# EAGLE design nanoController (EAGLE 9.6.1)
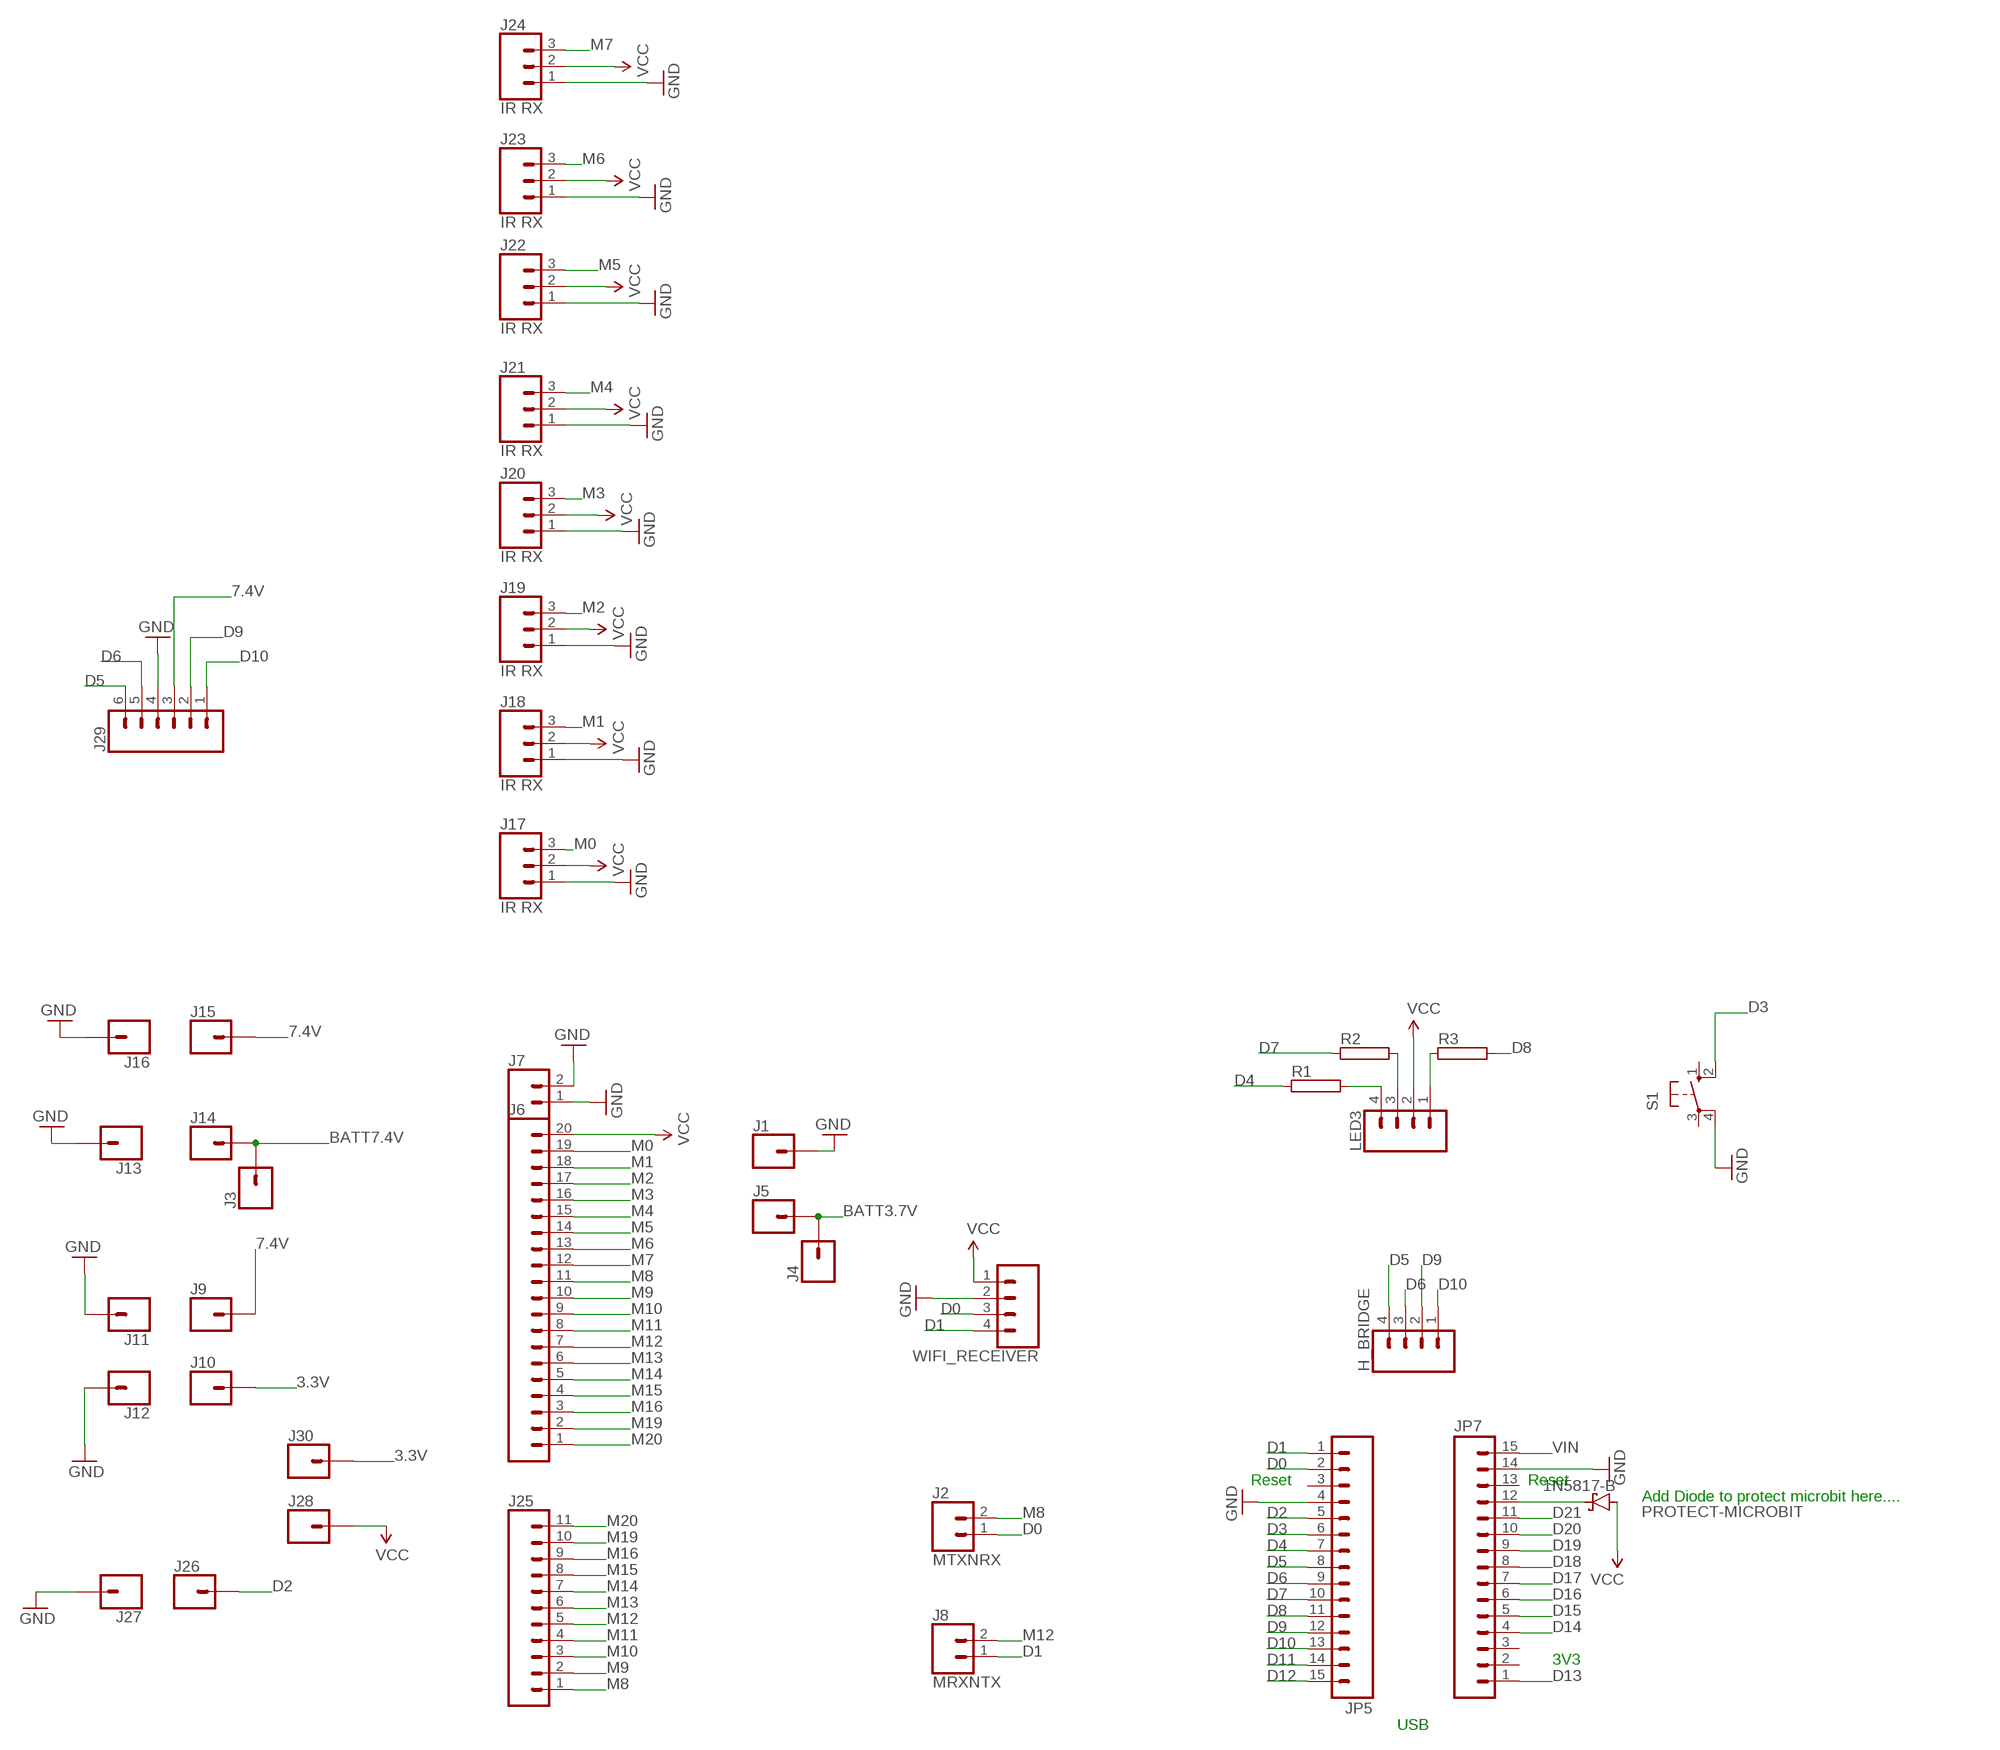
[diagram p0: schematic, sheet 1]

## Parts
H_BRIDGE  CONN_04LONGPADS  [1X04_LONGPADS]
J1  CONN_01SMTSO-256-ET-0.165DIA  [SMTSO-256-ET-0.165DIA]
J2  MTXNRX  CONN_02  [1X02]
J3  CONN_01  [1X01]
J4  CONN_01  [1X01]
J5  CONN_01SMTSO-256-ET-0.165DIA  [SMTSO-256-ET-0.165DIA]
J6  CONN_20  [1X20]
J7  CONN_02  [1X02]
J8  MRXNTX  CONN_02  [1X02]
J9  CONN_01  [1X01]
J10  CONN_01  [1X01]
J11  CONN_01  [1X01]
J12  CONN_01  [1X01]
J13  CONN_01  [1X01]
J14  CONN_01  [1X01]
J15  CONN_01  [1X01]
J16  CONN_01  [1X01]
J17  IR RX  CONN_03  [1X03]
J18  IR RX  CONN_03  [1X03]
J19  IR RX  CONN_03  [1X03]
J20  IR RX  CONN_03  [1X03]
J21  IR RX  CONN_03  [1X03]
J22  IR RX  CONN_03  [1X03]
J23  IR RX  CONN_03  [1X03]
J24  IR RX  CONN_03  [1X03]
J25  CONN_11  [1X11]
J26  CONN_01  [1X01]
J27  CONN_01  [1X01]
J28  CONN_01  [1X01]
J29  CONN_06SILK_FEMALE_PTH  [1X06]
J30  CONN_01  [1X01]
JP5  M15  [1X15]
JP7  M15  [1X15]
LED3  CONN_04LONGPADS  [1X04_LONGPADS]
PROTECT-MICROBIT  1N5817-B  [DO41-7.6]
R1  RHPS58  [HPS58]
R2  RHPS58  [HPS58]
R3  RHPS58  [HPS58]
S1  10-XX  [B3F-10XX]
WIFI_RECEIVER  CONN_04LONGPADS  [1X04_LONGPADS]

## Nets
3.3V: J10.1 J30.1
7.4V: J9.1 J15.1 J29.3
BATT3.7V: J4.1 J5.P$1
BATT7.4V: J3.1 J14.1
D0: J2.1 JP5.2 WIFI_RECEIVER.3
D1: J8.1 JP5.1 WIFI_RECEIVER.4
D2: J26.1 JP5.5
D3: JP5.6 S1.2(S1)
D4: JP5.7 R1.1
D5: H_BRIDGE.4 J29.6 JP5.8
D6: H_BRIDGE.3 J29.5 JP5.9
D7: JP5.10 R2.1
D8: JP5.11 R3.2
D9: H_BRIDGE.2 J29.2 JP5.12
D10: H_BRIDGE.1 J29.1 JP5.13
D11: JP5.14
D12: JP5.15
D13: JP7.1
D14: JP7.4
D15: JP7.5
D16: JP7.6
D17: JP7.7
D18: JP7.8
D19: JP7.9
D20: JP7.10
D21: JP7.11
GND [gnd]: J1.P$1 J7.1 J7.2 J11.1 J12.1 J13.1 J16.1 J17.1 J18.1 J19.1 J20.1 J21.1 J22.1 J23.1 J24.1 J27.1 J29.4 JP5.4 JP7.14 S1.4(P1) WIFI_RECEIVER.2
M0: J6.19 J17.3
M1: J6.18 J18.3
M2: J6.17 J19.3
M3: J6.16 J20.3
M4: J6.15 J21.3
M5: J6.14 J22.3
M6: J6.13 J23.3
M7: J6.12 J24.3
M8: J2.2 J6.11 J25.1
M9: J6.10 J25.2
M10: J6.9 J25.3
M11: J6.8 J25.4
M12: J6.7 J8.2 J25.5
M13: J6.6 J25.6
M14: J6.5 J25.7
M15: J6.4 J25.8
M16: J6.3 J25.9
M19: J6.2 J25.10
M20: J6.1 J25.11
N$1: LED3.4 R1.2
N$2: LED3.3 R2.2
N$3: LED3.1 R3.1
N$4: JP7.12 PROTECT-MICROBIT.C
VCC: J6.20 J17.2 J18.2 J19.2 J20.2 J21.2 J22.2 J23.2 J24.2 J28.1 LED3.2 PROTECT-MICROBIT.A WIFI_RECEIVER.1
VIN: JP7.15
Unconnected: JP5.3 JP7.2 JP7.3 JP7.13 S1.1(S) S1.3(P)

## Notes on the sheet
- Reset | Reset
- Add Diode to protect microbit here....
- 3V3
- USB

## Library data of the parts
H_BRIDGE LED3 WIFI_RECEIVER = SparkFun-Connectors:CONN_04: Multi connection point. Often used as Generic Header-pin footprint for 0.1 inch spaced/style header connections On any of the 0.1 inch spaced packages, you can populate with these: Break Away Headers - Straight <https://www.sparkfun.com/products/116> (PRT-00116) Break Away Male Headers - Right Angle <https://www.sparkfun.com/products/553> (PRT-00553) Female Headers <https://www.sparkfun.com/products/115> (PRT-00115) Break Away Headers - Machine Pin <https://www.sparkfun.com/products/117> (PRT-00117) Break Away Female Headers - Swiss Machine Pin <https://www.sparkfun.com/products/743> (PRT-00743) For SCREWTERMINALS and SPRING TERMINALS visit here: Screw Terimnals on SparkFun.com <https://www.sparkfun.com/search/results?term=Screw+Terminals> (5mm/3.5mm/2.54mm spacing) This device is also useful as a general connection point to wire up your design to another part of your project. Our various solder wires solder well into these plated through hole pads. Hook-Up Wire - Assortment (Stranded, 22 AWG) <https://www.sparkfun.com/products/11375> (PRT-11375) Hook-Up Wire - Assortment (Solid Core, 22 AWG) <https://www.sparkfun.com/products/11367> (PRT-11367) View the entire wire category on our website here <https://www.sparkfun.com/categories/141> Special notes: Molex polarized connector foot print use with SKU : PRT-08231 with associated crimp pins and housings. 1MM SMD Version SKU: PRT-10208; PROD_ID: CONN-09696
J1 J5 = SparkFun-Connectors:CONN_01: Single connection point. Often used as Generic Header-pin footprint for 0.1 inch spaced/style header connections On any of the 0.1 inch spaced packages, you can populate with these: Break Away Headers - Straight <https://www.sparkfun.com/products/116> (PRT-00116) Break Away Male Headers - Right Angle <https://www.sparkfun.com/products/553> (PRT-00553) Female Headers <https://www.sparkfun.com/products/115> (PRT-00115) Break Away Headers - Machine Pin <https://www.sparkfun.com/products/117> (PRT-00117) Break Away Female Headers - Swiss Machine Pin <https://www.sparkfun.com/products/743> (PRT-00743) This device is also useful as a general connection point to wire up your design to another part of your project. Our various solder wires solder well into these plated through hole pads. Hook-Up Wire - Assortment (Stranded, 22 AWG) <https://www.sparkfun.com/products/11375> (PRT-11375) Hook-Up Wire - Assortment (Solid Core, 22 AWG) <https://www.sparkfun.com/products/11367> (PRT-11367) View the entire wire category on our website here <https://www.sparkfun.com/categories/141> Special notes: SMTSO-256-ET is a "flush mount" nut for a 4-40 screw. We mostly use this on specialty testbeds; it is a nice way to connect hardware to your PCB at an adjustable hieght. Also note, the SNAP packages are for using a snappable style connector. We sell a baggie of snaps and they are also used on two LilyPad designs: Snap Assortment - 30 pack (male and female) <https://www.sparkfun.com/products/11347> (DEV-11347) LilyPad Arduino SimpleSnap <https://www.sparkfun.com/products/10941> (DEV-10941) LilyPad SimpleSnap Protoboard <https://www.sparkfun.com/products/10940> (DEV-10940); PROD_ID: HW-08694
J2 J7 J8 = SparkFun-Connectors:CONN_02: Multi connection point. Often used as Generic Header-pin footprint for 0.1 inch spaced/style header connections On any of the 0.1 inch spaced packages, you can populate with these: Break Away Headers - Straight <https://www.sparkfun.com/products/116> (PRT-00116) Break Away Male Headers - Right Angle <https://www.sparkfun.com/products/553> (PRT-00553) Female Headers <https://www.sparkfun.com/products/115> (PRT-00115) Break Away Headers - Machine Pin <https://www.sparkfun.com/products/117> (PRT-00117) Break Away Female Headers - Swiss Machine Pin <https://www.sparkfun.com/products/743> (PRT-00743) For SCREWTERMINALS and SPRING TERMINALS visit here: Screw Terimnals on SparkFun.com <https://www.sparkfun.com/search/results?term=Screw+Terminals> (5mm/3.5mm/2.54mm spacing) This device is also useful as a general connection point to wire up your design to another part of your project. Our various solder wires solder well into these plated through hole pads. Hook-Up Wire - Assortment (Stranded, 22 AWG) <https://www.sparkfun.com/products/11375> (PRT-11375) Hook-Up Wire - Assortment (Solid Core, 22 AWG) <https://www.sparkfun.com/products/11367> (PRT-11367) View the entire wire category on our website here <https://www.sparkfun.com/categories/141> Special notes: Molex polarized connector foot print use with: PRT-08233 with associated crimp pins and housings. 2.54_SCREWTERM for use with PRT-10571. 3.5mm Screw Terminal footprints for PRT-08084 5mm Screw Terminal footprints for use with PRT-08432
J3 J4 J9-J16 J26-J28 J30 = SparkFun-Connectors:CONN_01: Single connection point. Often used as Generic Header-pin footprint for 0.1 inch spaced/style header connections On any of the 0.1 inch spaced packages, you can populate with these: Break Away Headers - Straight <https://www.sparkfun.com/products/116> (PRT-00116) Break Away Male Headers - Right Angle <https://www.sparkfun.com/products/553> (PRT-00553) Female Headers <https://www.sparkfun.com/products/115> (PRT-00115) Break Away Headers - Machine Pin <https://www.sparkfun.com/products/117> (PRT-00117) Break Away Female Headers - Swiss Machine Pin <https://www.sparkfun.com/products/743> (PRT-00743) This device is also useful as a general connection point to wire up your design to another part of your project. Our various solder wires solder well into these plated through hole pads. Hook-Up Wire - Assortment (Stranded, 22 AWG) <https://www.sparkfun.com/products/11375> (PRT-11375) Hook-Up Wire - Assortment (Solid Core, 22 AWG) <https://www.sparkfun.com/products/11367> (PRT-11367) View the entire wire category on our website here <https://www.sparkfun.com/categories/141> Special notes: SMTSO-256-ET is a "flush mount" nut for a 4-40 screw. We mostly use this on specialty testbeds; it is a nice way to connect hardware to your PCB at an adjustable hieght. Also note, the SNAP packages are for using a snappable style connector. We sell a baggie of snaps and they are also used on two LilyPad designs: Snap Assortment - 30 pack (male and female) <https://www.sparkfun.com/products/11347> (DEV-11347) LilyPad Arduino SimpleSnap <https://www.sparkfun.com/products/10941> (DEV-10941) LilyPad SimpleSnap Protoboard <https://www.sparkfun.com/products/10940> (DEV-10940)
J6 = SparkFun-Connectors:CONN_20: Multi connection point. Often used as Generic Header-pin footprint for 0.1 inch spaced/style header connections On any of the 0.1 inch spaced packages, you can populate with these: Break Away Headers - Straight <https://www.sparkfun.com/products/116> (PRT-00116) Break Away Male Headers - Right Angle <https://www.sparkfun.com/products/553> (PRT-00553) Female Headers <https://www.sparkfun.com/products/115> (PRT-00115) Break Away Headers - Machine Pin <https://www.sparkfun.com/products/117> (PRT-00117) Break Away Female Headers - Swiss Machine Pin <https://www.sparkfun.com/products/743> (PRT-00743) For SCREWTERMINALS and SPRING TERMINALS visit here: Screw Terimnals on SparkFun.com <https://www.sparkfun.com/search/results?term=Screw+Terminals> (5mm/3.5mm/2.54mm spacing) This device is also useful as a general connection point to wire up your design to another part of your project. Our various solder wires solder well into these plated through hole pads. Hook-Up Wire - Assortment (Stranded, 22 AWG) <https://www.sparkfun.com/products/11375> (PRT-11375) Hook-Up Wire - Assortment (Solid Core, 22 AWG) <https://www.sparkfun.com/products/11367> (PRT-11367) View the entire wire category on our website here <https://www.sparkfun.com/categories/141> Special notes: Molex polarized connector foot print use with SKU : PRT-08231 with associated crimp pins and housings. 1MM SMD Version SKU: PRT-10208 NOTES ON THE VARIANTS LOCK and LOCK_LONGPADS... This footprint was designed to help hold the alignment of a through-hole component (i.e. 6-pin header) while soldering it into place. You may notice that each hole has been shifted either up or down by 0.005 of an inch from it's more standard position (which is a perfectly straight line). This slight alteration caused the pins (the squares in the middle) to touch the edges of the holes. Because they are alternating, it causes a "brace" to hold the component in place. 0.005 has proven to be the perfect amount of "off-center" position when using our standard breakaway headers. Although looks a little odd when you look at the bare footprint, once you have a header in there, the alteration is very hard to notice. Also,if you push a header all the way into place, it is covered up entirely on the bottom side. Note about LOCK SPECIAL package: This is just like the LOCK variant in that the holes are staggared by 5 mil, but except for the last two holes. They are not altered from the "standard" footprint layout. This is used for a special purpose on the layout of our Graphic LCD Backpack. Make sure you want to use this device before selecting it for you project!
J17-J24 = SparkFun-Connectors:CONN_03: Multi connection point. Often used as Generic Header-pin footprint for 0.1 inch spaced/style header connections On any of the 0.1 inch spaced packages, you can populate with these: Break Away Headers - Straight <https://www.sparkfun.com/products/116> (PRT-00116) Break Away Male Headers - Right Angle <https://www.sparkfun.com/products/553> (PRT-00553) Female Headers <https://www.sparkfun.com/products/115> (PRT-00115) Break Away Headers - Machine Pin <https://www.sparkfun.com/products/117> (PRT-00117) Break Away Female Headers - Swiss Machine Pin <https://www.sparkfun.com/products/743> (PRT-00743) Stackable Header - 3 Pin (Female, 0.1") <https://www.sparkfun.com/products/13875> (PRT-13875) For SCREWTERMINALS and SPRING TERMINALS visit here: Screw Terimnals on SparkFun.com <https://www.sparkfun.com/search/results?term=Screw+Terminals> (5mm/3.5mm/2.54mm spacing) This device is also useful as a general connection point to wire up your design to another part of your project. Our various solder wires solder well into these plated through hole pads. Hook-Up Wire - Assortment (Stranded, 22 AWG) <https://www.sparkfun.com/products/11375> (PRT-11375) Hook-Up Wire - Assortment (Solid Core, 22 AWG) <https://www.sparkfun.com/products/11367> (PRT-11367) View the entire wire category on our website here <https://www.sparkfun.com/categories/141> Special notes: Molex polarized connector foot print use with SKU : PRT-08232 with associated crimp pins and housings.; PROD_ID: XXX-00000; VALUE: 455-1750-1-ND
J25 = SparkFun-Connectors:CONN_11: Multi connection point. Often used as Generic Header-pin footprint for 0.1 inch spaced/style header connections On any of the 0.1 inch spaced packages, you can populate with these: Break Away Headers - Straight <https://www.sparkfun.com/products/116> (PRT-00116) Break Away Male Headers - Right Angle <https://www.sparkfun.com/products/553> (PRT-00553) Female Headers <https://www.sparkfun.com/products/115> (PRT-00115) Break Away Headers - Machine Pin <https://www.sparkfun.com/products/117> (PRT-00117) Break Away Female Headers - Swiss Machine Pin <https://www.sparkfun.com/products/743> (PRT-00743) For SCREWTERMINALS and SPRING TERMINALS visit here: Screw Terimnals on SparkFun.com <https://www.sparkfun.com/search/results?term=Screw+Terminals> (5mm/3.5mm/2.54mm spacing) This device is also useful as a general connection point to wire up your design to another part of your project. Our various solder wires solder well into these plated through hole pads. Hook-Up Wire - Assortment (Stranded, 22 AWG) <https://www.sparkfun.com/products/11375> (PRT-11375) Hook-Up Wire - Assortment (Solid Core, 22 AWG) <https://www.sparkfun.com/products/11367> (PRT-11367) View the entire wire category on our website here <https://www.sparkfun.com/categories/141>
J29 = SparkFun-Connectors:CONN_06: Multi connection point. Often used as Generic Header-pin footprint for 0.1 inch spaced/style header connections On any of the 0.1 inch spaced packages, you can populate with these: Break Away Headers - Straight <https://www.sparkfun.com/products/116> (PRT-00116) Break Away Male Headers - Right Angle <https://www.sparkfun.com/products/553> (PRT-00553) Female Headers <https://www.sparkfun.com/products/115> (PRT-00115) Break Away Headers - Machine Pin <https://www.sparkfun.com/products/117> (PRT-00117) Break Away Female Headers - Swiss Machine Pin <https://www.sparkfun.com/products/743> (PRT-00743) Arduino Stackable Header - 6 Pin <https://www.sparkfun.com/products/9280> (PRT-09280) For SCREWTERMINALS and SPRING TERMINALS visit here: Screw Terimnals on SparkFun.com <https://www.sparkfun.com/search/results?term=Screw+Terminals> (5mm/3.5mm/2.54mm spacing) This device is also useful as a general connection point to wire up your design to another part of your project. Our various solder wires solder well into these plated through hole pads. Hook-Up Wire - Assortment (Stranded, 22 AWG) <https://www.sparkfun.com/products/11375> (PRT-11375) Hook-Up Wire - Assortment (Solid Core, 22 AWG) <https://www.sparkfun.com/products/11367> (PRT-11367) View the entire wire category on our website here <https://www.sparkfun.com/categories/141>; PROD_ID: CONN-08437
JP5 JP7 = SparkFun-Connectors:M15: Header 15 Standard 15-pin 0.1" header. Use with straight break away headers (SKU : PRT-00116), right angle break away headers (PRT-00553), swiss pins (PRT-00743), machine pins (PRT-00117), and female headers (PRT-00115).
PROTECT-MICROBIT = diode:1N581*: 1.0A SCHOTTKY BARRIER RECTIFIER Source: http://www.diodes.com/datasheets/ds23001.pdf
R1-R3 = resistor-power:R: Power Resitor; OC_FARNELL: unknown; OC_NEWARK: unknown
S1 = switch-omron:10-XX: OMRON SWITCH; MPN: B3F-1000; OC_FARNELL: 176432; OC_NEWARK: 36M3542

## Net classes
0 default: width 0.254 mm, clearance 0.254 mm
1 power: width 0.61 mm, drill 0.711 mm, clearance 0.33 mm
2 gnd: width 0.305 mm, drill 0.711 mm, clearance 0.254 mm
3 usbvcc: width 0.508 mm, drill 0.711 mm, clearance 0.254 mm
4 aref: width 0.406 mm

## Board
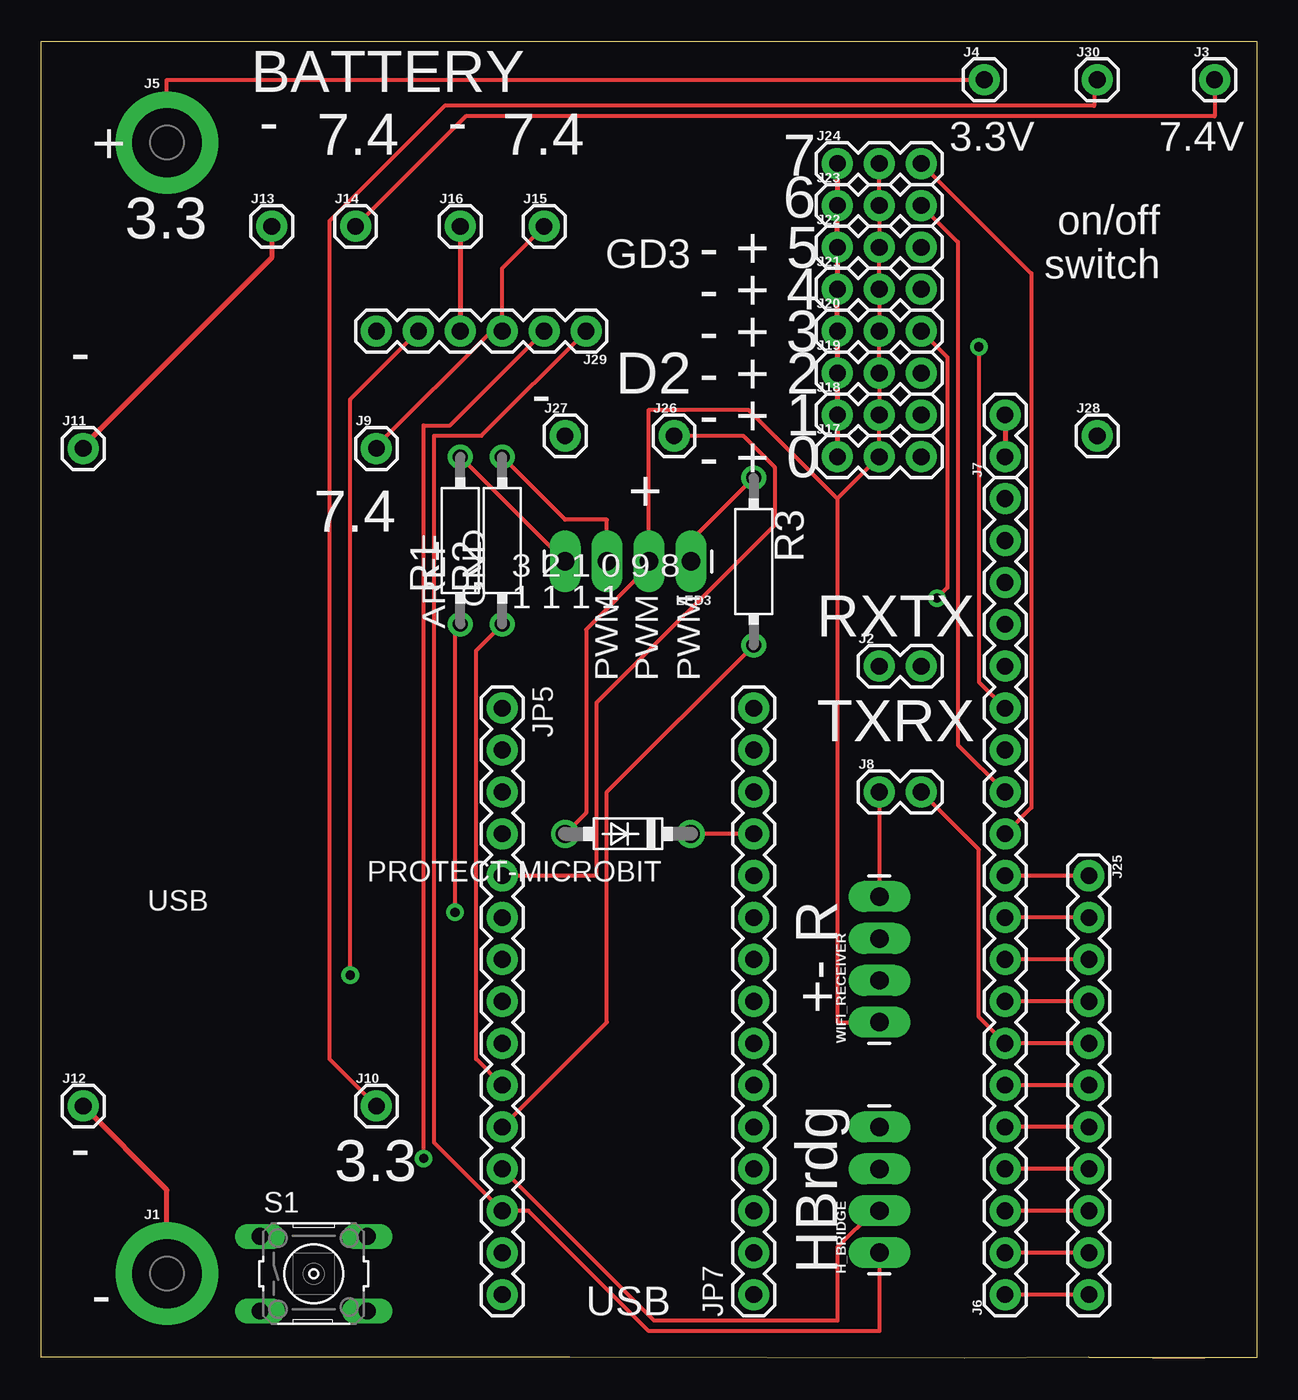
[diagram p1: board, top side]
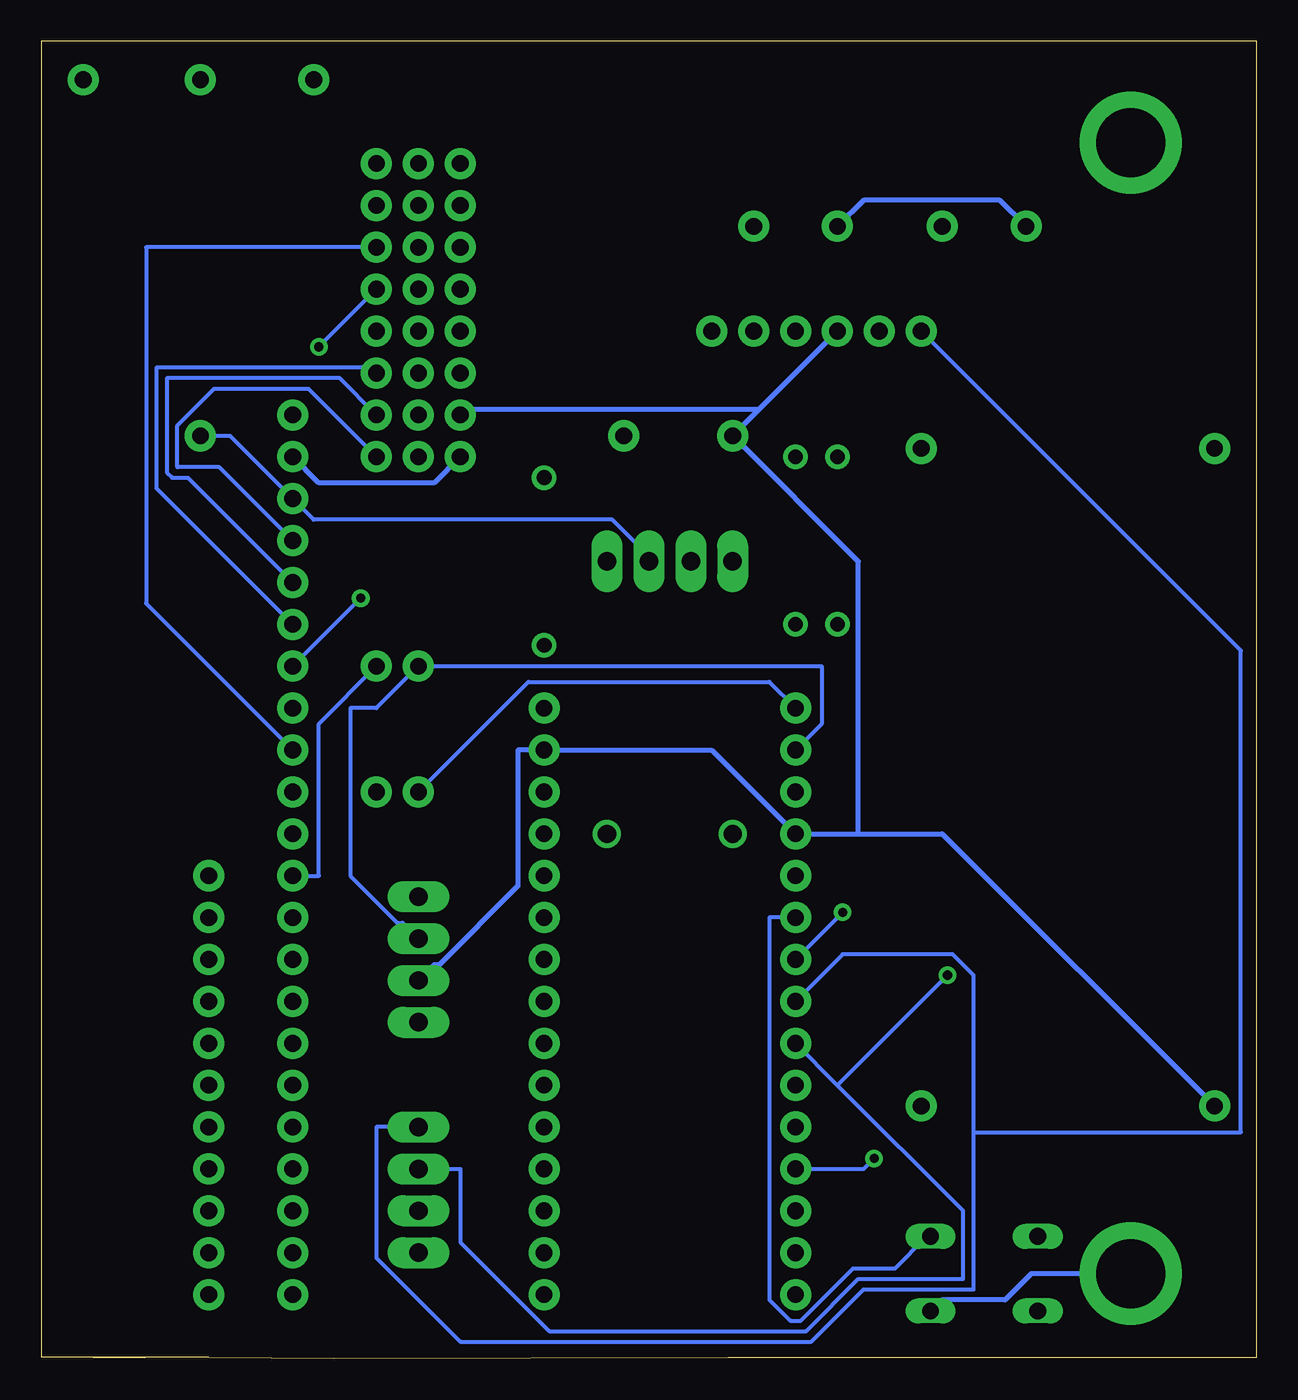
[diagram p2: board, bottom side, seen from below]

Size 73.66 x 79.86 mm. Coordinates in mm from the lower left corner, seen from the top.
Outline: 73.66,0.05 73.66,79.86 0,79.86 0,0.05 32.03,0.05 55.93,0 63.5,0.05 73.66,0.05
Outline: 67.36,0 73.66,0.05
Copper layers (1*16): Top 0.035mm / dielectric 1.5mm / Bottom 0.035mm
Design rules "default": minimum track width 10mil, minimum drill 22mil, track to track 10mil, track to pad 10mil, pad to pad 10mil, via to via 16mil, smd to smd 8mil, copper to edge 30mil, drill to drill 12mil, minimum pad ring 10mil, minimum via ring 10mil, stop-mask expansion 4mil, vias tented up to drill 0mil, thermal gap 10mil
vRestrict: area 25.4,45.5 to 27.1,49.2; area 33.4,41.1 to 34.9,44.6; area 35.9,41.1 to 37.5,44.6; area 38.5,41.1 to 40,44.6; area 42.5,38.7 to 43.1,38.9

### Footprints (pad centres in the part's own frame; a part is rotated, then mirrored left to right if it is on the bottom)
1X04_LONGPADS = drill 1.118 pad 1.88 long: 1 0,0; 2 2.54,0; 3 5.08,0; 4 7.62,0
SMTSO-256-ET-0.165DIA = drill 4.191 pad 6.198: P$1 0,0
1X02 = drill 1.016 pad 1.88: 1 0,0; 2 2.54,0
1X01 = drill 1.016 pad 1.88: 1 0,0
1X20 = drill 1.016 pad 1.88: 1 0,0; 2 2.54,0; 3 5.08,0; 4 7.62,0; 5 10.16,0; 6 12.7,0; 7 15.24,0; 8 17.78,0; 9 20.32,0; 10 22.86,0; 11 25.4,0; 12 27.94,0; 13 30.48,0; 14 33.02,0; 15 35.56,0; 16 38.1,0; 17 40.64,0; 18 43.18,0; 19 45.72,0; 20 48.26,0
1X03 = drill 1.016 pad 1.88: 1 0,0; 2 2.54,0; 3 5.08,0
1X11 = drill 1.016 pad 1.88: 1 0,0; 2 2.54,0; 3 5.08,0; 4 7.62,0; 5 10.16,0; 6 12.7,0; 7 15.24,0; 8 17.78,0; 9 20.32,0; 10 22.86,0; 11 25.4,0
1X06 = drill 1.016 pad 1.88: 1 0,0; 2 2.54,0; 3 5.08,0; 4 7.62,0; 5 10.16,0; 6 12.7,0
1X15 = drill 1.016 pad 1.88: 1 0,0; 2 2.54,0; 3 5.08,0; 4 7.62,0; 5 10.16,0; 6 12.7,0; 7 15.24,0; 8 17.78,0; 9 20.32,0; 10 22.86,0; 11 25.4,0; 12 27.94,0; 13 30.48,0; 14 33.02,0; 15 35.56,0
DO41-7.6 = drill 1.1 pad 1.7: A 3.81,0; C -3.81,0
HPS58 = drill 0.9 pad 1.5: 1 -5.08,0; 2 5.08,0
B3F-10XX = drill 1.016 long: 1 -3.251,2.261; 2 3.251,2.261; 3 -3.251,-2.261; 4 3.251,-2.261

### Placement (x,y rotation side)
H_BRIDGE  50.8,6.4 90 top
J1  7.62,5.13 0 top
J2  50.8,41.96 0 top
J3  71.12,77.52 0 top
J4  57.15,77.52 0 top
J5  7.62,73.71 0 top
J6  58.42,3.86 90 top
J7  58.42,54.66 90 top
J8  50.8,34.34 0 top
J9  20.32,55.17 0 top
J10  20.32,15.29 0 top
J11  2.54,55.17 0 top
J12  2.54,15.29 0 top
J13  13.97,68.63 0 top
J14  19.05,68.63 0 top
J15  30.48,68.63 0 top
J16  25.4,68.63 0 top
J17  48.26,54.66 0 top
J18  48.26,57.2 0 top
J19  48.26,59.74 0 top
J20  48.26,62.28 0 top
J21  48.26,64.82 0 top
J22  48.26,67.36 0 top
J23  48.26,69.9 0 top
J24  48.26,72.44 0 top
J25  63.5,29.26 270 top
J26  38.35,55.93 0 top
J27  31.75,55.93 0 top
J28  64.01,55.93 0 top
J29  33.02,62.28 180 top
J30  64.01,77.52 0 top
JP5  27.94,39.42 270 top
JP7  43.18,3.86 90 top
LED3  39.37,48.31 180 top
PROTECT-MICROBIT  35.56,31.8 180 top
R1  25.4,49.58 90 top
R2  27.94,49.58 90 top
R3  43.18,48.31 270 top
S1  16.51,5.13 0 top
WIFI_RECEIVER  50.8,20.37 90 top

### Tracks (layer width: path | path; a pad name or v marks a point on that pad's centre or on a via)
3.3V
  Top 0.254: J10.1 17.46,18.15 17.46,68.95 24.45,75.93 63.82,75.93 63.82,77.52 J30.1
7.4V
  Top 0.254: J9.1 20.32,55.3 27.3,62.28 J29.3 27.94,66.09 J15.1
BATT3.7V
  Top 0.254: J4.1 7.62,77.52 J5.P$1
BATT7.4V
  Top 0.254: J14.1 25.72,75.3 71.12,75.3 J3.1
D0
  Bottom 0.254: JP5.2 26.35,38.47 26.35,41.96 J2.1 53.34,39.42 54.93,39.42 54.93,29.26 52.07,26.4 51.75,26.4 WIFI_RECEIVER.3
D1
  Top 0.254: J8.1 WIFI_RECEIVER.4
  Bottom 0.254: JP5.1 29.53,41.01 44.13,41.01 J8.1
D2
  Top 0.254: JP5.5 33.66,29.26 33.66,39.74 44.45,50.53 44.45,54.03 42.55,55.93 J26.1
D3
  Bottom 0.254: JP5.6 29.53,26.72 29.53,3.54 28.26,2.27 27.62,2.27 24.45,5.45 21.91,5.45 20,7.35 S1.2
D4  (via drill 0.56)
  Top 0.254: R1.1 25.08,44.18 v25.08,27.04
  Bottom 0.254: JP5.7 v25.08,27.04
D5
  Bottom 0.254: JP5.8 25.08,24.5 18.41,24.5 17.14,23.23 17.14,13.7 | 17.14,13.7 17.14,4.18 23.81,4.18 26.99,1 48.26,1 53.34,6.08 53.34,14.02 H_BRIDGE.4 | J29.6 0.95,42.91 0.95,13.7 17.14,13.7
D6  (via drill 0.56)
  Top 0.254: J29.5 18.73,58.15 v18.73,23.23
  Bottom 0.254: 25.4,16.56 17.78,8.94 17.78,4.81 24.13,4.81 27.3,1.64 42.86,1.64 48.26,7.04 48.26,11.48 H_BRIDGE.3 | 25.4,16.56 JP5.9 | 25.4,16.56 v18.73,23.23
D7
  Top 0.254: R2.1 26.35,42.91 26.35,18.15 JP5.10
D8
  Top 0.254: R3.2 34.29,34.34 34.29,20.37 JP5.11
D9  (via drill 0.56)
  Top 0.254: JP5.12 37.15,2.27 48.26,2.27 48.26,6.72 50.48,8.94 H_BRIDGE.2 | J29.2 24.77,56.57 23.18,56.57 v23.18,12.12
  Bottom 0.254: v23.18,12.12 23.81,11.48 JP5.12
D10
  Top 0.254: H_BRIDGE.1 50.8,1.64 36.83,1.64 29.53,8.94 JP5.13 23.81,13.07 23.81,55.93 26.67,55.93 J29.1
GND
  Top 0.305: J24.1 J23.1 J22.1 J21.1 J20.1 J19.1 J18.1 J17.1 | J7.2 J7.1 | J16.1 J29.4 | J13.1 13.97,66.73 2.54,55.3 J11.1 | J12.1 7.62,10.21 J1.P$1
  Bottom 0.305: J7.1 56.83,53.07 49.85,53.07 J17.1 | J29.4 30.16,57.52 | 30.16,57.52 J27.1 24.13,48.31 24.13,31.8 | J16.1 23.81,70.22 15.56,70.22 J13.1 | J18.1 47.94,57.52 30.16,57.52 | J1.P$1 13.65,5.13 15.24,3.54 19.05,3.54 19.68,2.91 S1.4 | WIFI_RECEIVER.2 49.85,23.86 49.53,23.86 44.77,28.63 44.77,36.88 JP7.14 33.02,36.88 JP5.4 24.13,31.8 | J12.1 19.05,31.8 24.13,31.8
M0
  Bottom 0.254: J17.3 57.47,58.79 63.18,58.79 65.41,56.57 65.41,54.03 62.87,54.03 J6.19
M1
  Bottom 0.254: J6.18 64.77,53.39 65.72,53.39 66.04,53.71 66.04,59.42 55.56,59.42 J18.3
M2
  Bottom 0.254: J6.17 66.67,52.76 66.67,60.06 53.66,60.06 J19.3
M3  (via drill 0.56)
  Top 0.254: v54.29,46.09 54.93,46.72 54.93,60.69 J20.3
  Bottom 0.254: v54.29,46.09 J6.16
M4  (via drill 0.56)
  Top 0.254: J6.15 56.83,41.01 v56.83,61.33
  Bottom 0.254: J21.3 v56.83,61.33
M5
  Bottom 0.254: J6.14 67.31,45.77 67.31,67.36 J22.3
M6
  Top 0.254: J6.13 55.56,37.2 55.56,67.68 J23.3
M7
  Top 0.254: J6.12 60.01,33.39 60.01,65.77 J24.3
M8
  Top 0.254: J25.1 J6.11
  Bottom 0.254: J2.2 56.83,38.47 56.83,29.26 J6.11
M9
  Top 0.254: J25.2 J6.10
M10
  Top 0.254: J25.3 J6.9
M11
  Top 0.254: J25.4 J6.8
M12
  Top 0.254: J25.5 J6.7 56.83,20.69 56.83,30.85 J8.2
M13
  Top 0.254: J25.6 J6.6
M14
  Top 0.254: J25.7 J6.5
M15
  Top 0.254: J25.8 J6.4
M16
  Top 0.254: J25.9 J6.3
M19
  Top 0.254: J25.10 J6.2
M20
  Top 0.254: J25.11 J6.1
N$1
  Top 0.254: LED3.4 R1.2
N$2
  Top 0.254: R2.2 31.75,50.85 34.29,50.85 LED3.3
N$3
  Top 0.254: R3.1 39.37,49.58 LED3.1
N$4
  Top 0.254: JP7.12 PROTECT-MICROBIT.C
VCC
  Top 0.254: J24.2 J23.2 J22.2 J21.2 J20.2 J19.2 J18.2 J17.2 48.26,52.12 | WIFI_RECEIVER.1 48.26,20.37 48.26,52.12 | PROTECT-MICROBIT.A 33.02,33.07 33.02,44.18 36.83,47.99 LED3.2 36.83,57.52 42.86,57.52 48.26,52.12
  Bottom 0.254: J28.1 62.23,55.93 J6.20 57.15,50.85 39.05,50.85 36.83,48.63 LED3.2

### Text on the board
tNames: 3 2 1 0 9 8 | GND | 1 1 1 1 | AREF | PWM | PWM | PWM | USB
Reference: C8 | C2 | R11 | C4 | C5
_tsilk: 3.3V | 7.4V | - | - | BATTERY / 7.4 | 7.4 | + | 7 | on/off / switch | 6 | 3.3 | GD3 | - + 5 | - + 4 | - + 3 | - | D2 | - + 2 | - | - + 1 | - + 0 | + | 7.4 | RXTX | TXRX | +- R | - | 3.3 | HBrdg | - | USB